# Altium schematic sheet DDR3.SchDoc
size A4; SheetNumber: 8; SheetTotal: 13
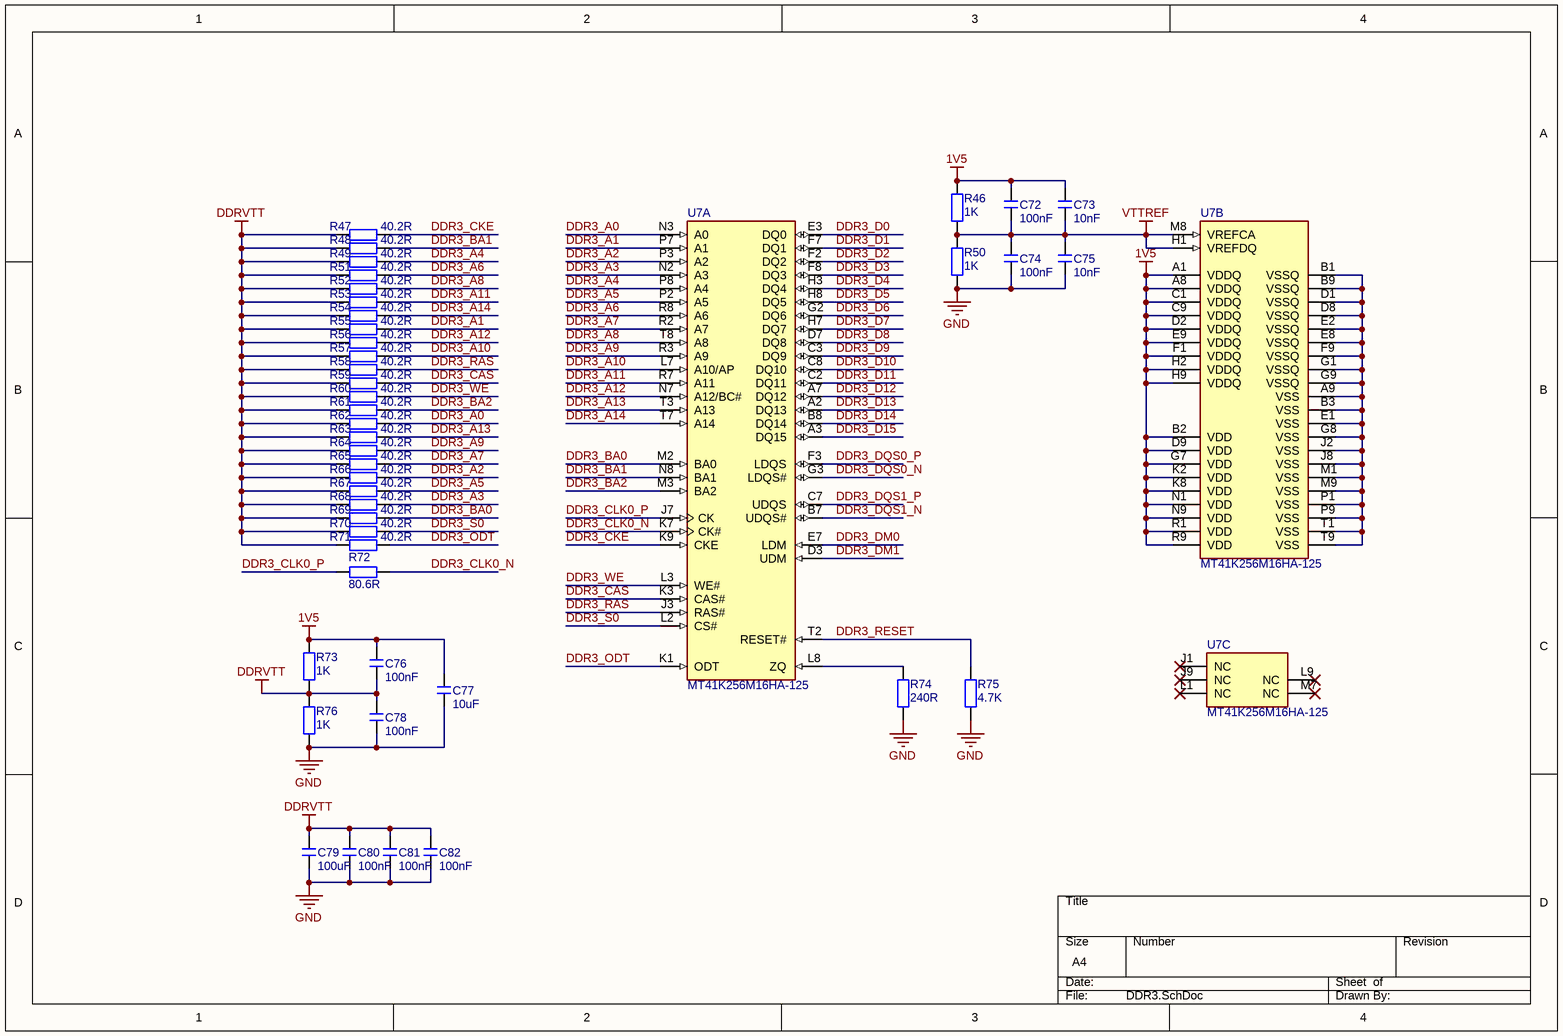
[diagram p0: DDR3.SchDoc]

## Parts
C72  100nF  [C 0402_L]
C73  10nF  [C 0402_L]
C74  100nF  [C 0402_L]
C75  10nF  [C 0402_L]
C76  100nF  [C 0402_L]
C77  10uF  [C 0603_L]
C78  100nF  [C 0402_L]
C79  100uF  [C 0805_L]
C80  100nF  [C 0402_L]
C81  100nF  [C 0402_L]
C82  100nF  [C 0402_L]
R46  1K  [R 0402_L]
R47  40.2R  [R 0805_L]
R48  40.2R  [R 0805_L]
R49  40.2R  [R 0805_L]
R50  1K  [R 0402_L]
R51  40.2R  [R 0805_L]
R52  40.2R  [R 0805_L]
R53  40.2R  [R 0805_L]
R54  40.2R  [R 0805_L]
R55  40.2R  [R 0805_L]
R56  40.2R  [R 0805_L]
R57  40.2R  [R 0805_L]
R58  40.2R  [R 0805_L]
R59  40.2R  [R 0805_L]
R60  40.2R  [R 0805_L]
R61  40.2R  [R 0805_L]
R62  40.2R  [R 0805_L]
R63  40.2R  [R 0805_L]
R64  40.2R  [R 0805_L]
R65  40.2R  [R 0805_L]
R66  40.2R  [R 0805_L]
R67  40.2R  [R 0805_L]
R68  40.2R  [R 0805_L]
R69  40.2R  [R 0805_L]
R70  40.2R  [R 0805_L]
R71  40.2R  [R 0805_L]
R72  80.6R  [R 0805_L]
R73  1K  [R 0402_L]
R74  240R  [R 0805_L]
R75  4.7K  [R 0402_L]
R76  1K  [R 0402_L]
U7  MT41K256M16HA-125  [BGA96C80P9X16_800X1300X120]  (parts A,B,C of 3)

## Nets
1V5: C72.2 C73.2 C76.2 C77.2 R46.2 R73.1 U7.A1(VDDQ) U7.A8(VDDQ) U7.B2(VDD) U7.C1(VDDQ) U7.C9(VDDQ) U7.D2(VDDQ) U7.D9(VDD) U7.E9(VDDQ) U7.F1(VDDQ) U7.G7(VDD) U7.H2(VDDQ) U7.H9(VDDQ) U7.K2(VDD) U7.K8(VDD) U7.N1(VDD) U7.N9(VDD) U7.R1(VDD) U7.R9(VDD)
DDRVTT: C76.1 C78.2 C79.2 C80.2 C81.2 C82.2 R47.2 R48.2 R49.2 R51.2 R52.2 R53.2 R54.2 R55.2 R56.2 R57.2 R58.2 R59.2 R60.2 R61.2 R62.2 R63.2 R64.2 R65.2 R66.2 R67.2 R68.2 R69.2 R70.2 R71.2 R73.2 R76.1
GND: C74.1 C75.1 C77.1 C78.1 C79.1 C80.1 C81.1 C82.1 R50.1 R74.2 R75.2 R76.2
VTTREF: C72.1 C73.1 C74.2 C75.2 R46.1 R50.2 U7.H1(VREFDQ) U7.M8(VREFCA)
DDR3_A0: R62.1 U7.N3(A0)
DDR3_A1: R55.1 U7.P7(A1)
DDR3_A2: R66.1 U7.P3(A2)
DDR3_A3: R68.1 U7.N2(A3)
DDR3_A4: R49.1 U7.P8(A4)
DDR3_A5: R67.1 U7.P2(A5)
DDR3_A6: R51.1 U7.R8(A6)
DDR3_A7: R65.1 U7.R2(A7)
DDR3_A8: R52.1 U7.T8(A8)
DDR3_A9: R64.1 U7.R3(A9)
DDR3_A10: R57.1 U7.L7(A10/AP)
DDR3_A11: R53.1 U7.R7(A11)
DDR3_A12: R56.1 U7.N7(A12/BC#)
DDR3_A13: R63.1 U7.T3(A13)
DDR3_A14: R54.1 U7.T7(A14)
DDR3_BA0: R69.1 U7.M2(BA0)
DDR3_BA1: R48.1 U7.N8(BA1)
DDR3_BA2: R61.1 U7.M3(BA2)
DDR3_CAS: R59.1 U7.K3(CAS#)
DDR3_CKE: R47.1 U7.K9(CKE)
DDR3_CLK0_N: R72.2 U7.K7(CK#)
DDR3_CLK0_P: R72.1 U7.J7(CK)
DDR3_D0: U7.E3(DQ0)
DDR3_D1: U7.F7(DQ1)
DDR3_D2: U7.F2(DQ2)
DDR3_D3: U7.F8(DQ3)
DDR3_D4: U7.H3(DQ4)
DDR3_D5: U7.H8(DQ5)
DDR3_D6: U7.G2(DQ6)
DDR3_D7: U7.H7(DQ7)
DDR3_D8: U7.D7(DQ8)
DDR3_D9: U7.C3(DQ9)
DDR3_D10: U7.C8(DQ10)
DDR3_D11: U7.C2(DQ11)
DDR3_D12: U7.A7(DQ12)
DDR3_D13: U7.A2(DQ13)
DDR3_D14: U7.B8(DQ14)
DDR3_D15: U7.A3(DQ15)
DDR3_DM0: U7.E7(LDM)
DDR3_DM1: U7.D3(UDM)
DDR3_DQS0_N: U7.G3(LDQS#)
DDR3_DQS0_P: U7.F3(LDQS)
DDR3_DQS1_N: U7.B7(UDQS#)
DDR3_DQS1_P: U7.C7(UDQS)
DDR3_ODT: R71.1 U7.K1(ODT)
DDR3_RAS: R58.1 U7.J3(RAS#)
DDR3_RESET: R75.1 U7.T2(RESET#)
DDR3_S0: R70.1 U7.L2(CS#)
DDR3_WE: R60.1 U7.L3(WE#)
NetR74_1: R74.1 U7.L8(ZQ)
NetU7_A9: U7.A9(VSS) U7.B1(VSSQ) U7.B3(VSS) U7.B9(VSSQ) U7.D1(VSSQ) U7.D8(VSSQ) U7.E1(VSS) U7.E2(VSSQ) U7.E8(VSSQ) U7.F9(VSSQ) U7.G1(VSSQ) U7.G8(VSS) U7.G9(VSSQ) U7.J2(VSS) U7.J8(VSS) U7.M1(VSS) U7.M9(VSS) U7.P1(VSS) U7.P9(VSS) U7.T1(VSS) U7.T9(VSS)

Not connected (* = marked no-connect by the designer): U7 J1(NC)* J9(NC)* L1(NC)* L9(NC)* M7(NC)*

## Library data of the parts
C72-C82 = C: 无极性贴片电容; 版权归属: 源创客; BOM名称: 无极性贴片电容; 学习资源: www.ooocke.com
R46-R76 = R: 贴片电阻; 版权归属: 源创客; BOM名称: 贴片电阻; 学习资源: www.ooocke.com
U7 = MT41K256M16HA-125: DDR3-16位数据-14位地址